# EAGLE design mic preamp (EAGLE 6.2)
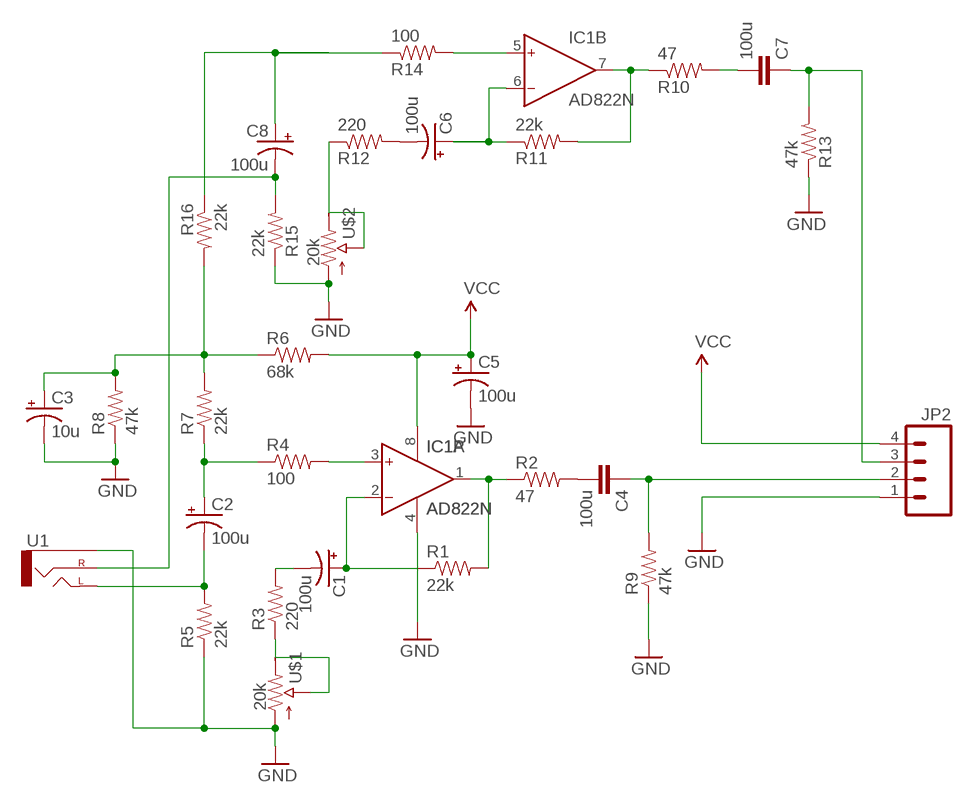
[diagram p0: schematic, sheet 1]

## Parts
C1  100u  CAP_POLPTH1  [CPOL-RADIAL-100UF-25V]
C2  100u  CAP_POLPTH1  [CPOL-RADIAL-100UF-25V]
C3  10u  CAP_POLPTH1  [CPOL-RADIAL-100UF-25V]
C4  100u  C2.5/4  [C2.5-4]
C5  100u  CAP_POLPTH1  [CPOL-RADIAL-100UF-25V]
C6  100u  CAP_POLPTH1  [CPOL-RADIAL-100UF-25V]
C7  100u  C2.5/4  [C2.5-4]
C8  100u  CAP_POLPTH1  [CPOL-RADIAL-100UF-25V]
IC1  AD822N  [DIL08]
JP2  M04POLAR  [MOLEX-1X4]
R1  22k  RESISTORPTH-1/6W  [1/6W-RES]
R2  47  RESISTORPTH-1/6W  [1/6W-RES]
R3  220  RESISTORPTH-1/6W  [1/6W-RES]
R4  100  RESISTORPTH-1/6W  [1/6W-RES]
R5  22k  RESISTORPTH-1/6W  [1/6W-RES]
R6  68k  RESISTORPTH-1/6W  [1/6W-RES]
R7  22k  RESISTORAXIAL-0.3  [AXIAL-0.3]
R8  47k  RESISTORPTH-1/6W  [1/6W-RES]
R9  47k  RESISTORPTH-1/6W  [1/6W-RES]
R10  47  RESISTORPTH-1/6W  [1/6W-RES]
R11  22k  RESISTORPTH-1/6W  [1/6W-RES]
R12  220  RESISTORPTH-1/6W  [1/6W-RES]
R13  47k  RESISTORPTH-1/6W  [1/6W-RES]
R14  100  RESISTORPTH-1/6W  [1/6W-RES]
R15  22k  RESISTORPTH-1/6W  [1/6W-RES]
R16  22k  RESISTORAXIAL-0.3  [AXIAL-0.3]
U1  AUDIO-JACKPTH  [AUDIO-JACK]
U$1  20k  POT-RV16AF-20  [POT_ALPHA_RV16AF-20]
U$2  20k  POT-RV16AF-20  [POT_ALPHA_RV16AF-20]

## Nets
GND: C3.2(-) C5.2(-) IC1.4(P:V-) JP2.1 R5.1 R8.1 R9.1 R13.1 R15.1 U1.SLEEVE U$1.1(A) U$2.1(A)
N$1: R3.1 U$1.2(S) U$1.3(E)
N$2: C1.2(-) R3.2
N$3: IC1.1(A:OUT) R1.2 R2.1
N$4: C4.2 R2.2
N$5: C1.1(+) IC1.2(A:IN-) R1.1
N$6: C2.2(-) R5.2 U1.TIP(LEFT)
N$7: C2.1(+) R4.1 R7.P$1
N$8: IC1.3(A:IN+) R4.2
N$9: C3.1(+) R6.1 R7.P$2 R8.2 R16.P$2
N$10: R12.1 U$2.2(S) U$2.3(E)
N$11: C6.2(-) R12.2
N$12: C6.1(+) IC1.6(B:IN-) R11.1
N$13: C4.1 JP2.2 R9.2
N$14: IC1.7(B:OUT) R10.1 R11.2
N$15: C8.2(-) R15.2 U1.RING(RIGHT)
N$16: C7.2 R10.2
N$17: C7.1 JP2.3 R13.2
N$18: C8.1(+) R14.1 R16.P$1
N$19: IC1.5(B:IN+) R14.2
VCC: C5.1(+) IC1.8(P:V+) JP2.4 R6.2

## Library data of the parts
C1-C3 C5 C6 C8 = SparkFun:CAP_POL: Capacitor Polarized These are standard SMD and PTH capacitors. Normally 10uF, 47uF, and 100uF in electrolytic and tantalum varieties. Always verify the external diameter of the through hole cap, it varies with capacity, voltage, and manufacturer. The EIA devices should be standard.
C4 C7 = capacitor-wima:C: CAPACITOR naming: grid - package width
IC1 = analog-devices:AD822: Single-Supply, Rail-to-Rail Low Power FET-Input Op Amp Source: http://www.analog.com/static/imported-files/data_sheets/AD822.pdf; OC_FARNELL: 1438581; OC_NEWARK: unknown
JP2 = SparkFun:M04: Header 4 Standard 4-pin 0.1" header. Use with straight break away headers (SKU : PRT-00116), right angle break away headers (PRT-00553), swiss pins (PRT-00743), machine pins (PRT-00117), and female headers (PRT-00115). Molex polarized connector foot print use with SKU : PRT-08231 with associated crimp pins and housings. 1MM SMD Version SKU: PRT-10208
R1-R16 = My Library:RESISTOR: Resistor Basic schematic elements and footprints for 0603, 1206, and PTH resistors.
U1 = SparkFun:AUDIO-JACK: 3.5mm Audio Jack Simple 3.5mm common PCB mount audio jack. SKU: PRT-08032
U$1 U$2 = My Library:POT

## Board
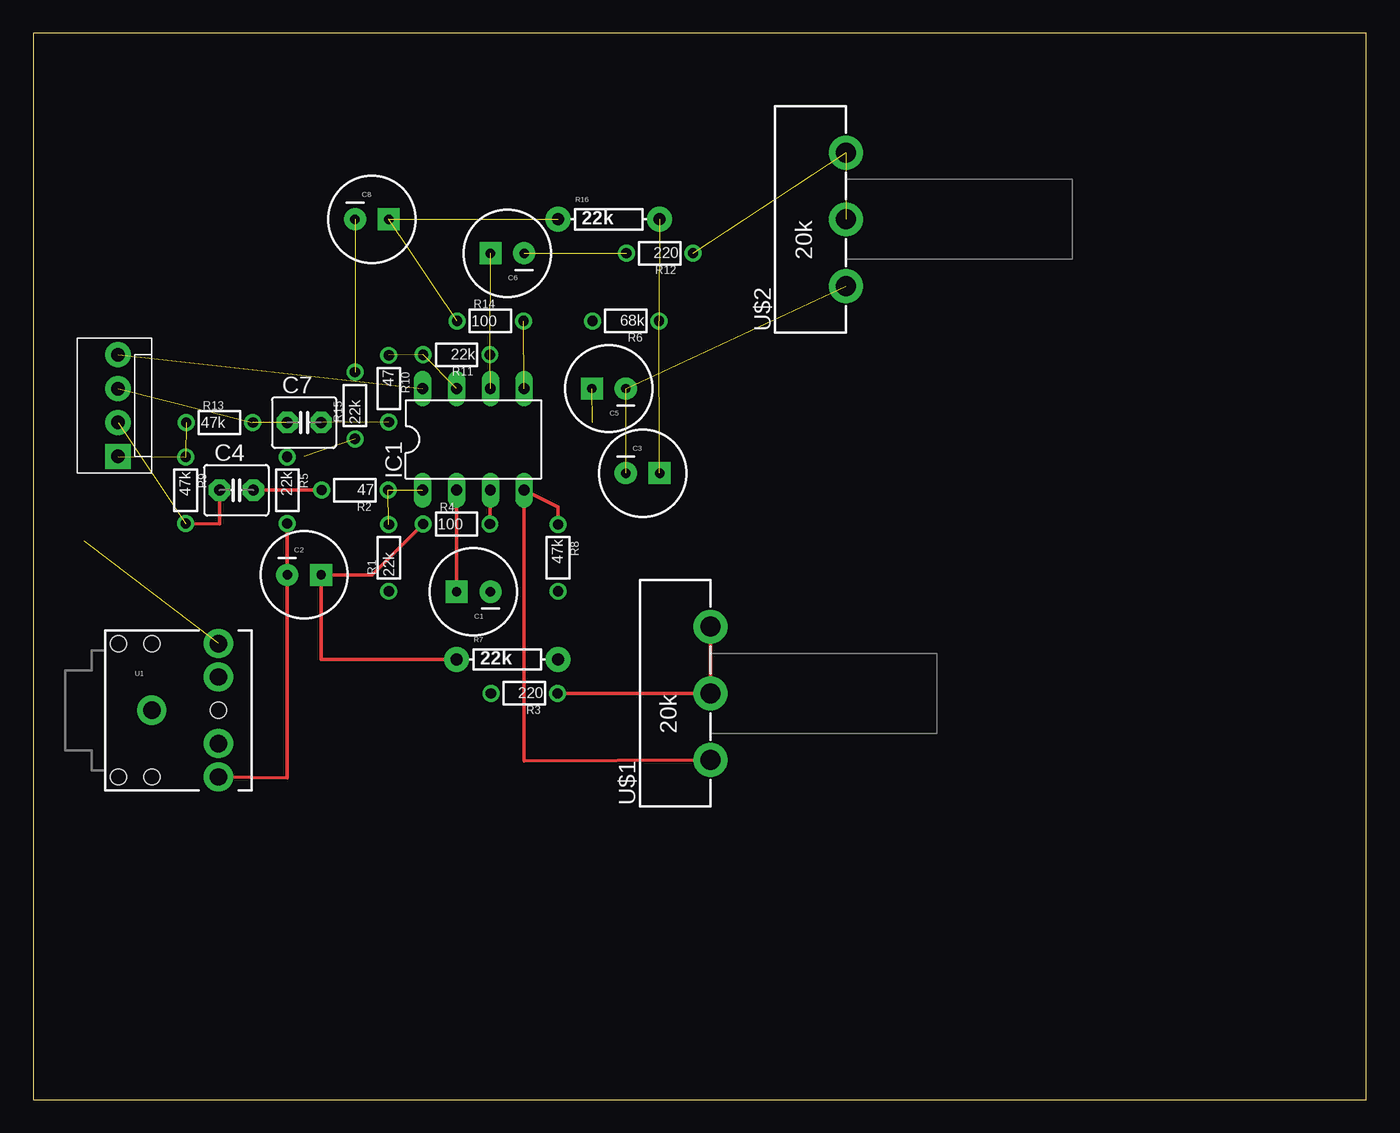
[diagram p1: board, top side]
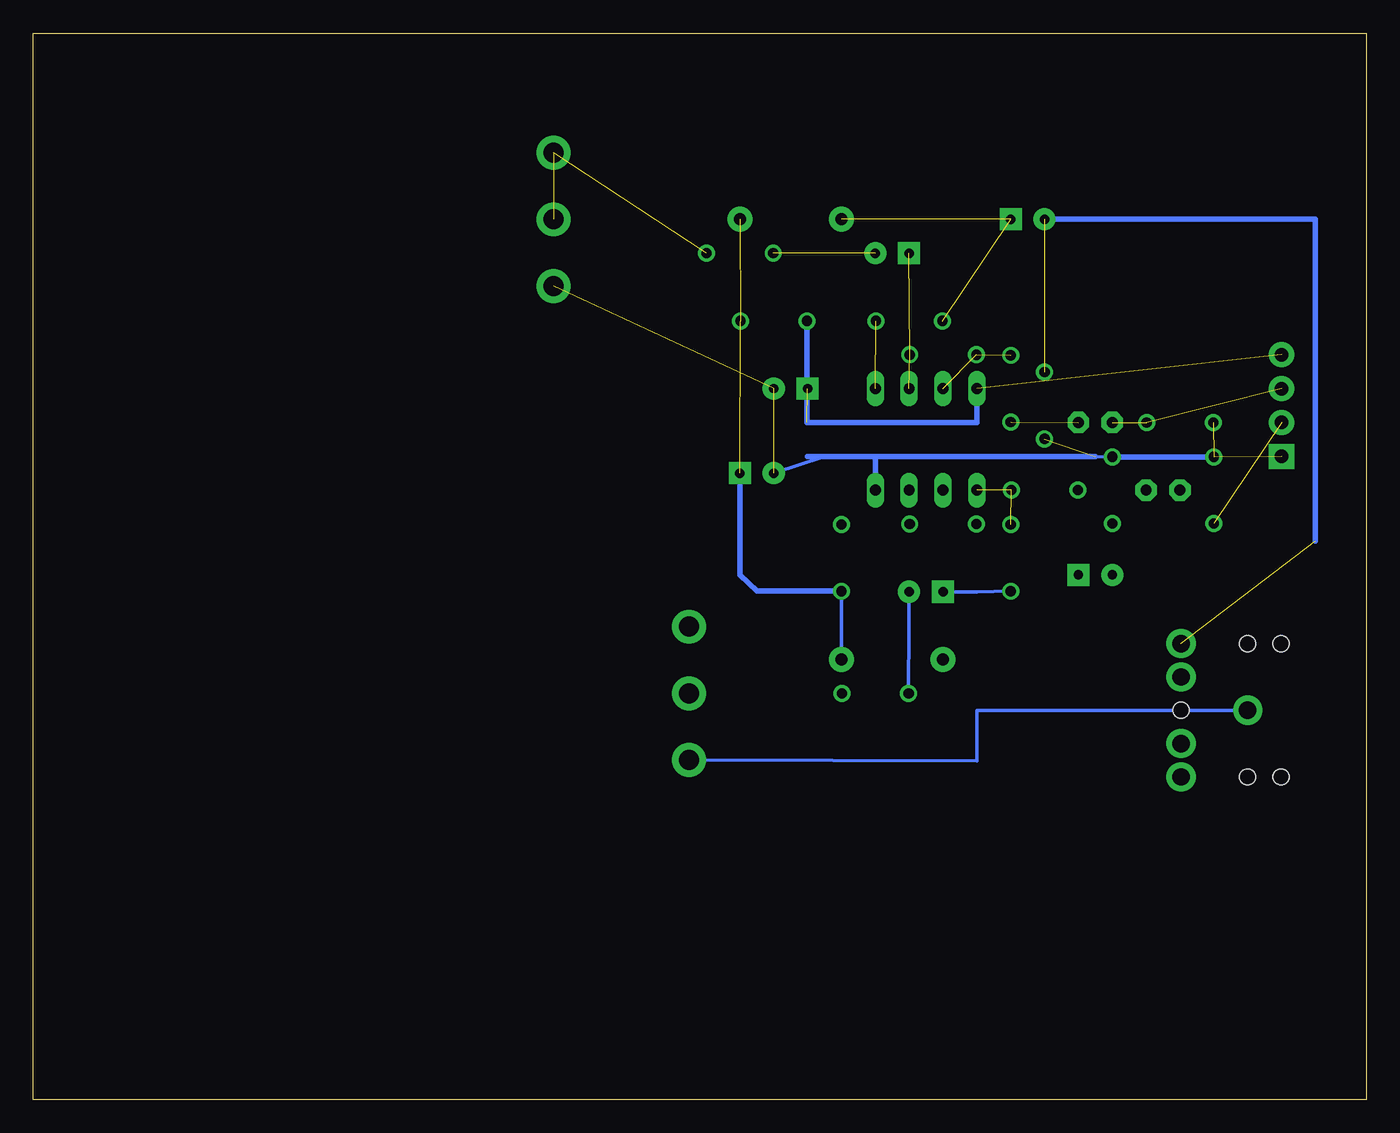
[diagram p2: board, bottom side, seen from below]

Size 100 x 80 mm. Coordinates in mm from the lower left corner, seen from the top.
Outline: 0,0 100,0 100,80 0,80 0,0
Copper layers (1*16): Top 0.035mm / dielectric 1.5mm / Bottom 0.035mm
Design rules: minimum track width 10mil, minimum drill 24mil, track to track 8mil, track to pad 8mil, pad to pad 8mil, via to via 8mil, smd to smd 8mil, copper to edge 40mil, drill to drill 8mil, minimum pad ring 10mil, minimum via ring 8mil, stop-mask expansion 4mil, vias tented up to drill 0mil, thermal gap 10mil

### Footprints (pad centres in the part's own frame; a part is rotated, then mirrored left to right if it is on the bottom)
CPOL-RADIAL-100UF-25V = drill 0.7 pad 1.651 square: 1 1.27,0 | drill 0.7 pad 1.651: 2 -1.27,0
C2.5-4 = drill 0.813 pad 1.6 octagon: 1 -1.27,0; 2 1.27,0
DIL08 = drill 0.813 long: 1 -3.81,-3.81; 2 -1.27,-3.81; 3 1.27,-3.81; 4 3.81,-3.81; 5 3.81,3.81; 6 1.27,3.81; 7 -1.27,3.81; 8 -3.81,3.81
MOLEX-1X4 = drill 1.016 pad 1.88 square: 1 0,0 | drill 1.016 pad 1.88: 2 2.54,0; 3 5.08,0; 4 7.62,0
1/6W-RES = drill 0.762: 1 -2.5,0; 2 2.5,0
AXIAL-0.3 = drill 0.9 pad 1.88: P$1 -3.81,0; P$2 3.81,0
AUDIO-JACK = drill 1.3 pad 2.184: RING 5,5; RSH 5,2.5; SLEEVE 0,0; TIP 5,-5; TSH 5,-2.5 | hole 1.2: 0,5; -2.5,5; -2.5,-5; 0,-5; 5,0
POT_ALPHA_RV16AF-20 = drill 1.5 pad 2.54: 1 -5,0; 2 0,0; 3 5,0

### Placement (x,y rotation side)
C1  33.02,38.1 180 top
C2  20.32,39.37 0 top
C3  45.72,46.99 0 top
C4  15.24,45.72 0 top
C5  43.18,53.34 180 top
C6  35.56,63.5 180 top
C7  20.32,50.8 0 top
C8  25.4,66.04 0 top
IC1  33.02,49.53 0 top
JP2  6.35,48.26 90 top
R1  26.67,40.64 90 top
R2  24.13,45.72 180 top
R3  36.83,30.48 180 top
R4  31.75,43.18 0 top
R5  19.05,45.72 270 top
R6  44.45,58.42 180 top
R7  35.56,33.02 0 top
R8  39.37,40.64 270 top
R9  11.43,45.72 270 top
R10  26.67,53.34 270 top
R11  31.75,55.88 180 top
R12  46.99,63.5 180 top
R13  13.97,50.8 0 top
R14  34.29,58.42 0 top
R15  24.13,52.07 90 top
R16  43.18,66.04 0 top
U1  8.89,29.21 0 top
U$1  50.8,30.48 90 top
U$2  60.96,66.04 90 top

### Tracks (layer width: path | path; a pad name or v marks a point on that pad's centre or on a via)
GND  (5 unrouted)
  Top 0.254: R8.1 39.37,44.45 IC1.4 36.83,25.4 U$1.1
  Bottom 0.254: U1.SLEEVE 20.32,29.21 29.21,29.21 29.21,25.4 U$1.1 | 20.32,48.26 R5.1 | C3.2 40.64,48.26
  Bottom 0.406: IC1.4 36.83,48.26 38.1,48.26 | 38.1,48.26 22.86,48.26 20.32,48.26 | 38.1,48.26 40.64,48.26 41.91,48.26 | R9.1 R5.1 19.05,48.26
N$1
  Top 0.254: R3.1 43.18,30.48 U$1.2 U$1.3
N$2
  Bottom 0.254: C1.2 34.29,35.56 R3.2
N$3  (2 unrouted)
N$4
  Top 0.254: C4.2 19.05,45.72 R2.2
N$5
  Top 0.254: C1.1 IC1.2
  Bottom 0.254: C1.1 29.21,38.1 R1.1
N$6
  Top 0.254: 19.05,36.83 19.05,40.64 | 19.05,36.83 C2.2 19.05,40.64 | 19.05,36.83 19.05,40.64 | 19.05,40.64 19.05,36.83 | 19.05,40.64 R5.2 | 19.05,40.64 19.05,36.83 | 19.05,36.83 19.05,24.13 U1.TIP
N$7
  Top 0.254: R7.P$1 21.59,33.02 C2.1 25.4,39.37 R4.1
N$8
  Top 0.254: IC1.3 R4.2
N$9  (2 unrouted)
  Bottom 0.254: R7.P$2 39.37,36.83 R8.2
  Bottom 0.406: R8.2 45.72,38.14 46.99,39.37 C3.1
N$10  (2 unrouted)
N$11  (1 unrouted)
N$12  (2 unrouted)
N$13  (1 unrouted)
  Top 0.254: C4.1 13.97,43.18 R9.2
N$14  (2 unrouted)
N$15  (2 unrouted)
  Bottom 0.406: C8.2 3.81,66.04 3.81,41.91
N$16  (1 unrouted)
N$17  (2 unrouted)
N$18  (2 unrouted)
N$19  (1 unrouted)
VCC  (2 unrouted)
  Bottom 0.406: IC1.8 29.21,50.8 41.91,50.8 41.95,50.8 R6.2